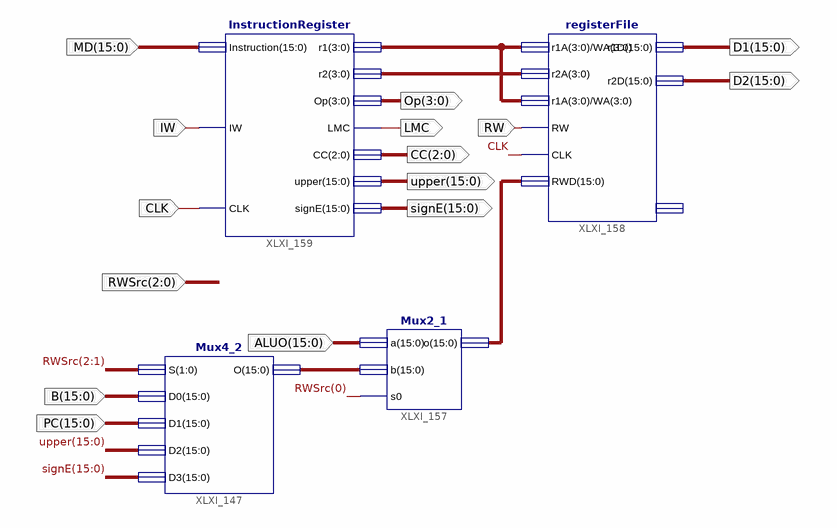
[diagram p0: schematic sheet 1]
// Xilinx ISE schematic IntegratedTestIR_RF.sch (spartan3e) as structural Verilog: 4 symbols, 15 ports
module IntegratedTestIR_RF (
  input  [15:0] MD,
  input  CLK,
  input  IW,
  input  RW,
  input  [15:0] B,
  input  [15:0] PC,
  input  [15:0] ALUO,
  input  [2:0] RWSrc,
  output [15:0] D2,
  output [3:0] Op,
  output [15:0] upper,
  output [15:0] signE,
  output LMC,
  output [2:0] CC,
  output [15:0] D1
);

  wire [3:0] XLXN_68, XLXN_69;
  wire [15:0] XLXN_605, XLXN_642;

  Mux2_1 XLXI_157 (
    .a(ALUO), .b(XLXN_605), .s0(RWSrc[0]),
    .o({XLXN_642[0], XLXN_642[1], XLXN_642[2], XLXN_642[3], XLXN_642[4], XLXN_642[5], XLXN_642[6], XLXN_642[7], XLXN_642[8], XLXN_642[9], XLXN_642[10], XLXN_642[11], XLXN_642[12], XLXN_642[13], XLXN_642[14], XLXN_642[15]}));
  Mux4_2 XLXI_147 (.S(RWSrc[2:1]), .D0(B), .D3(signE), .O(XLXN_605), .D1(PC), .D2(upper));
  registerFile XLXI_158 (
    .RW(RW), .CLK(CLK), .r1A(XLXN_68), .r2A(XLXN_69), .WA(XLXN_68),
    .RWD({XLXN_642[0], XLXN_642[1], XLXN_642[2], XLXN_642[3], XLXN_642[4], XLXN_642[5], XLXN_642[6], XLXN_642[7], XLXN_642[8], XLXN_642[9], XLXN_642[10], XLXN_642[11], XLXN_642[12], XLXN_642[13], XLXN_642[14], XLXN_642[15]}),
    .r1D(D1), .r2D(D2));  // open: display
  InstructionRegister XLXI_159 (
    .IW(IW), .CLK(CLK), .r1(XLXN_68), .r2(XLXN_69), .Instruction(MD), .signE(signE), .CC(CC), .upper(upper),
    .LMC(LMC), .Op(Op));
endmodule
